# EAGLE design leds_9dof_michi (EAGLE 7.2.0)
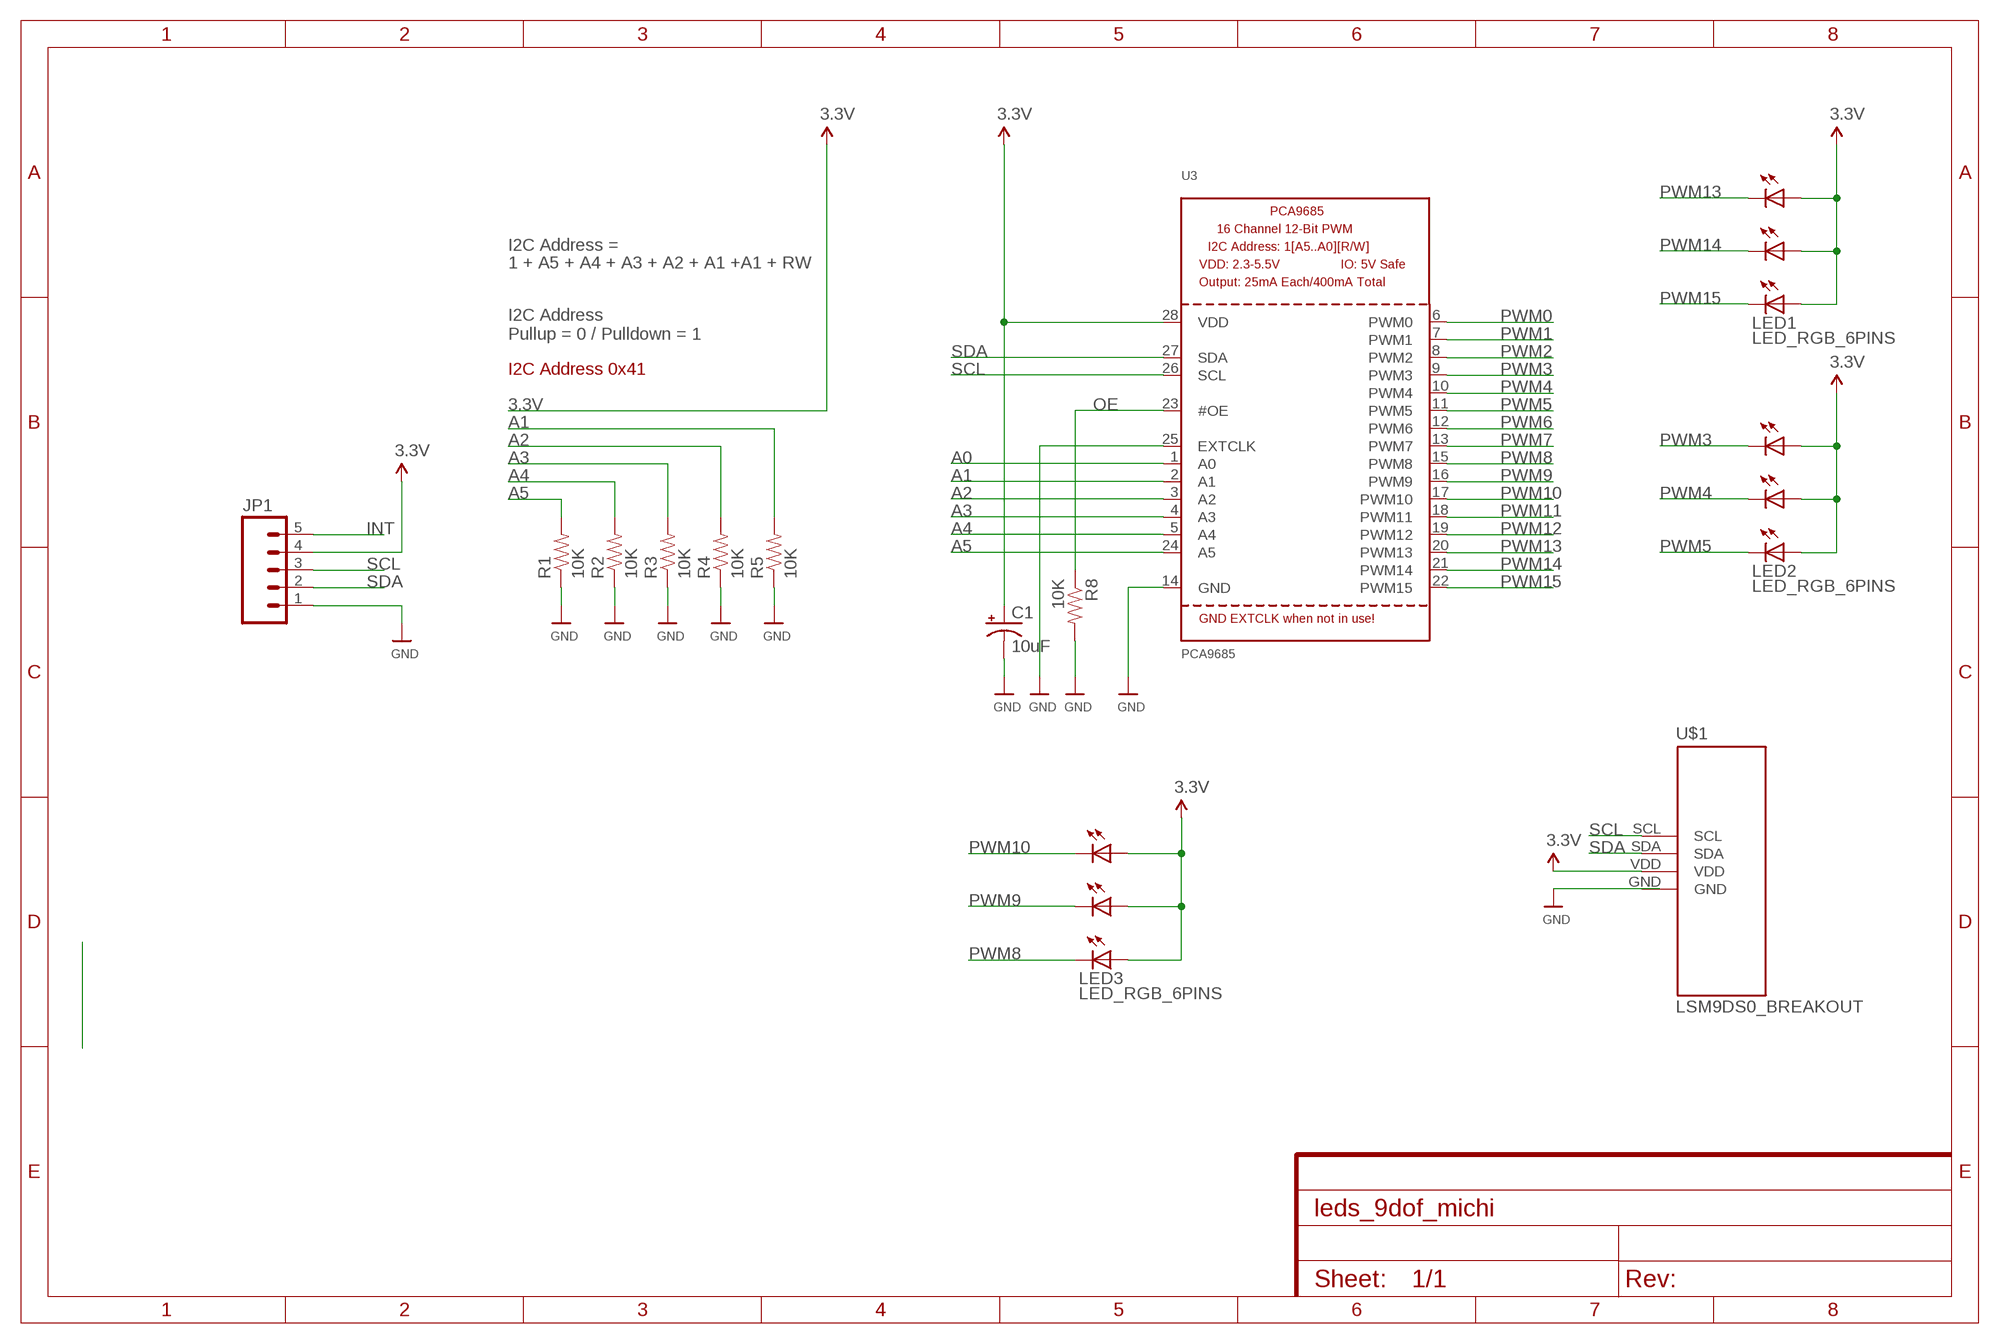
[diagram p0: schematic, sheet 1]

## Parts
C1  10uF  CAP_POL1206  [EIA3216]
JP1  M05PTH  [1X05]
LED1  LED_RGB_6PINS  [LED_RGB_6PINS]
LED2  LED_RGB_6PINS  [LED_RGB_6PINS]
LED3  LED_RGB_6PINS  [LED_RGB_6PINS]
R1  10K  RESISTOR1206  [1206]
R2  10K  RESISTOR1206  [1206]
R3  10K  RESISTOR1206  [1206]
R4  10K  RESISTOR1206  [1206]
R5  10K  RESISTOR1206  [1206]
R8  10K  RESISTOR1206  [1206]
U3  PCA9685  [TSSOP28]
U$1  LSM9DS0_BREAKOUT  [LSM9DS0_BREAKOUT]

## Nets
3.3V: C1.A(+) JP1.4 LED1.BA LED1.GA LED1.RA LED2.BA LED2.GA LED2.RA LED3.BA LED3.GA LED3.RA U3.28(VDD) U$1.VDD
A0: U3.1(A0)
A1: R5.2 U3.2(A1)
A2: R4.2 U3.3(A2)
A3: R3.2 U3.4(A3)
A4: R2.2 U3.5(A4)
A5: R1.2 U3.24(A5)
GND: C1.C(-) JP1.1 R1.1 R2.1 R3.1 R4.1 R5.1 R8.2 U3.14(GND) U3.25(EXTCLK)
INT: JP1.5
OE: R8.1 U3.23(#OE)
PWM0: U3.6(PWM0)
PWM1: U3.7(PWM1)
PWM2: U3.8(PWM2)
PWM3: LED2.BC U3.9(PWM3)
PWM4: LED2.RC U3.10(PWM4)
PWM5: LED2.GC U3.11(PWM5)
PWM6: U3.12(PWM6)
PWM7: U3.13(PWM7)
PWM8: LED3.GC U3.15(PWM8)
PWM9: LED3.RC U3.16(PWM9)
PWM10: LED3.BC U3.17(PWM10)
PWM11: U3.18(PWM11)
PWM12: U3.19(PWM12)
PWM13: LED1.BC U3.20(PWM13)
PWM14: LED1.RC U3.21(PWM14)
PWM15: LED1.GC U3.22(PWM15)
SCL: JP1.3 U3.26(SCL) U$1.SCL
SDA: JP1.2 U3.27(SDA) U$1.SDA

## Notes on the sheet
- I2C Address =
- 1 + A5 + A4 + A3 + A2 + A1 +A1 + RW
- I2C Address
  Pullup = 0 / Pulldown = 1
- I2C Address 0x41

## Power pins joined to a net without a drawn wire
GND: U$1.GND

## Library data of the parts
C1 = SparkFun-Passives:CAP_POL: Capacitor Polarized These are standard SMD and PTH capacitors. Normally 10uF, 47uF, and 100uF in electrolytic and tantalum varieties. Always verify the external diameter of the through hole cap, it varies with capacity, voltage, and manufacturer. The EIA devices should be standard.
JP1 = SparkFun-Connectors:M05: Header 5 Standard 5-pin 0.1" header. Use with straight break away headers (SKU : PRT-00116), right angle break away headers (PRT-00553), swiss pins (PRT-00743), machine pins (PRT-00117), and female headers (PRT-00115). Molex polarized connector foot print use with SKU : PRT-08230 with associated crimp pins and housings.
LED1-LED3 = Mlab_ProEx2015:LED_RGB_6PINS
R1-R5 R8 = SparkFun-Resistors:RESISTOR: Resistor Basic schematic elements and footprints for 0603, 1206, and PTH resistors.
U3 = microbuilder:PCA9685: PCA9685 - 16 Channel 12-Bit I2C PWM Controller 5.0V tolerant 16 channel, 12-bit I2C PWM controller with 25mA per output (max. 400mA total) Digikey: 568-5931-1-ND
U$1 = Mlab_ProEx2015:LSM9DS0_BREAKOUT

## Board
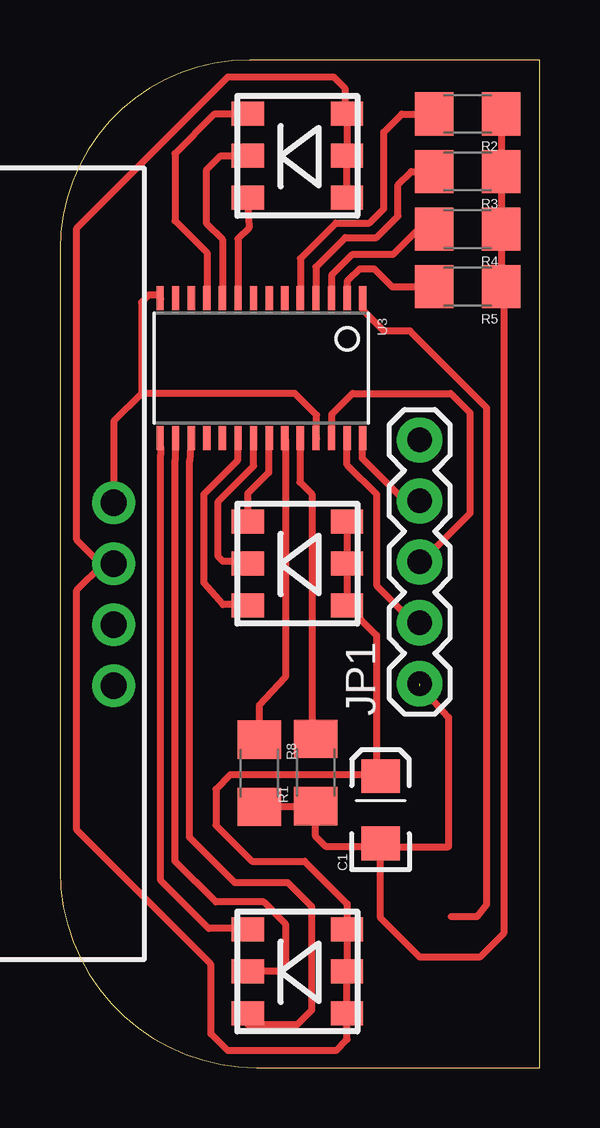
[diagram p1: board, top side]
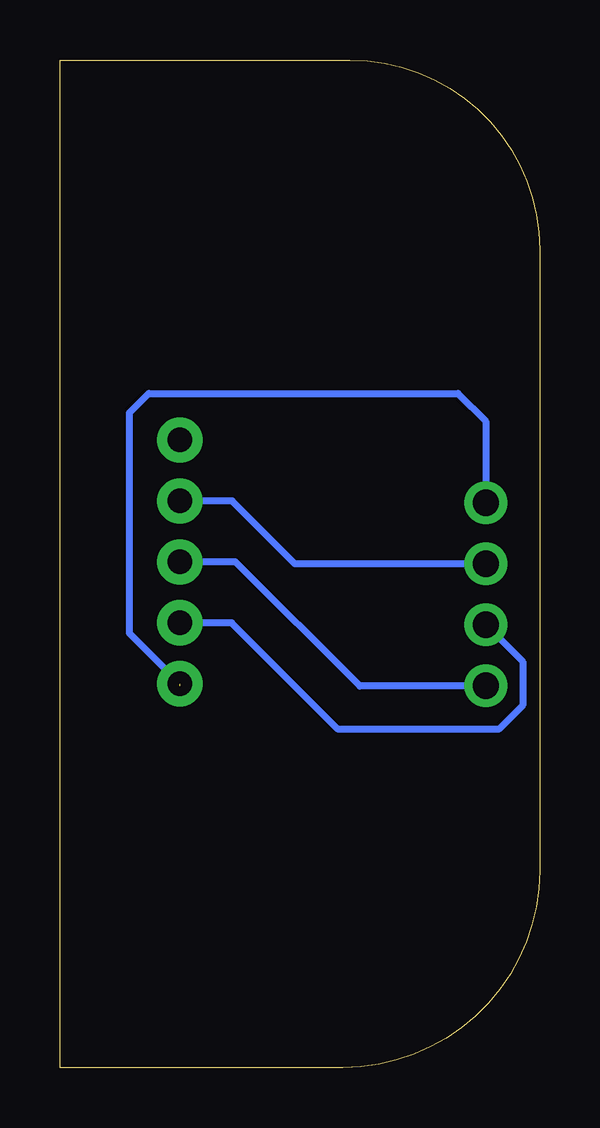
[diagram p2: board, bottom side, seen from below]

Size 20 x 42 mm. Coordinates in mm from the lower left corner, seen from the top.
Outline: 0,8.2 arc90 8.2,0 20,0 20,42 7.9,42 arc90 0,34.1 0,8.2
Copper layers (1*16): Top 0.035mm / dielectric 1.5mm / Bottom 0.035mm
Design rules "mdx40_0mm3_v2": minimum track width 0.2mm, minimum drill 0.6mm, track to track 0.3mm, track to pad 0.3mm, pad to pad 0.3mm, via to via 0.3mm, smd to smd 0.3mm, copper to edge 0.1mm, drill to drill 0.5mm, minimum pad ring 12mil, minimum via ring 10mil, stop-mask expansion 4mil, vias tented up to drill 25mil, thermal gap 0.1mm

### Footprints (pad centres in the part's own frame; a part is rotated, then mirrored left to right if it is on the bottom)
EIA3216 = smd 1.4 x 1.6: A 1.4,0; C -1.4,0
1X05 = drill 1.016 pad 1.88: 1 0,0; 2 2.54,0; 3 5.08,0; 4 7.62,0; 5 10.16,0
LED_RGB_6PINS = smd 1 x 1.35: BA -1.749,-2.07; BC -1.749,2.07; GA 1.751,-2.07; GC 1.751,2.07; RA 0.001,-2.07; RC 0.001,2.07
1206 = smd 1.6 x 1.8: 1 -1.4,0; 2 1.4,0
TSSOP28 = smd 0.305 x 0.991: 1 -4.225,-2.918; 2 -3.575,-2.918; 3 -2.925,-2.918; 4 -2.275,-2.918; 5 -1.625,-2.918; 6 -0.975,-2.918; 7 -0.325,-2.918; 8 0.325,-2.918; 9 0.975,-2.918; 10 1.625,-2.918; 11 2.275,-2.918; 12 2.925,-2.918; 13 3.575,-2.918; 14 4.225,-2.918; 15 4.225,2.918; 16 3.575,2.918; 17 2.925,2.918; 18 2.275,2.918; 19 1.625,2.918; 20 0.975,2.918; 21 0.325,2.918; 22 -0.325,2.918; 23 -0.975,2.918; 24 -1.625,2.918; 25 -2.275,2.918; 26 -2.925,2.918; 27 -3.575,2.918; 28 -4.225,2.918
LSM9DS0_BREAKOUT = drill 1.1 pad 1.778: GND 2.54,-2.54; SCL -5.08,-2.54; SDA -2.54,-2.54; VDD 0,-2.54

### Placement (x,y rotation side)
C1  13.37,10.74 90 top
JP1  15,16 90 top
LED1  9.9,21 90 top
LED2  9.9,38 90 top
LED3  9.9,4 90 top
R1  10.66,12.3 90 top
R2  17,39.75 180 top
R3  17,37.35 180 top
R4  17,34.95 180 top
R5  17,32.55 180 top
R8  8.31,12.27 270 top
U3  8.4,29.16 180 top
U$1  -0.3,21 90 top

### Tracks (layer width: path | path; a pad name or v marks a point on that pad's centre or on a via)
3.3V
  Top 0.3: LED3.BA 12,2.42 | LED3.BA LED3.RA LED3.GA 11.97,6.83 10.2,8.6 8,8.6 6.5,10.1 6.5,11.6 7.1,12.2 12.8,12.2 13.05,12.45 | LED2.BA LED2.RA LED2.GA 11.9,40.32 11.9,40.8 11.4,41.3 7,41.3 0.7,35 0.7,22 1.7,21 U$1.VDD 1.8,21 0.7,19.9 0.7,9.9 6.3,4.3 6.3,1.4 7,0.7 11.5,0.7 11.97,1.17 LED3.BA | LED1.GA LED1.RA LED1.BA 13.2,18.02 13.2,12.6 13.05,12.45 | U3.28 12.6,26.21 12.6,25.4 14.38,23.62 JP1.4 | C1.A 13.06,12.45 13.05,12.45
  Bottom 0.3: U$1.VDD 10.2,21 12.82,23.62 JP1.4
A0
  Top 0.3: 16.3,6.3 17.4,6.3 17.8,6.8 17.8,27.5 14.6,30.7 13.5,30.7 12.62,31.57 U3.1
A1
  Top 0.3: U3.2 11.97,32.77 12.5,33.3 13.1,33.3 13.85,32.55 R5.2
A2
  Top 0.3: U3.3 11.32,33.02 12.2,33.9 13.9,33.9 14.95,34.95 R4.2
A3
  Top 0.3: U3.4 10.68,33.38 11.9,34.6 13.2,34.6 14.1,35.5 14.1,36.8 14.65,37.35 R3.2
A4
  Top 0.3: U3.5 10.03,33.73 11.5,35.2 12.9,35.2 13.5,35.8 13.5,39 14.25,39.75 R2.2
A5
  Top 0.3: U3.24 10,26.21 10,24.4 10.5,23.9 10.5,13.94 R1.2
GND  (1 unrouted)
  Top 0.3: C1.C 13.22,9.2 11.1,9.2 10.66,9.63 R1.1 10.63,10.87 R8.2 | C1.C 13.52,9.2 16.2,9.2 16.2,14.6 15,15.9 | U3.25 10.7,26.21 10.7,27.2 9.8,28.1 3.4,28.1 | 3.4,28.1 2.24,26.94 U$1.GND | 4.2,32.05 U3.14 4.05,32.2 3.7,32.2 3.4,31.9 3.4,28.1 | R2.1 R3.1 R4.1 R5.1 18.5,32.45 18.5,5.6 17.5,4.6 15,4.6 13.37,6.23 C1.C
  Bottom 0.3: JP1.1 17.1,18.1 17.1,27.3 16.3,28.1 3.4,28.1 2.24,26.94 U$1.GND
OE
  Top 0.3: U3.23 9.4,26.16 9.4,16.28 8.31,15.09 R8.1
PWM3
  Top 0.3: LED2.BC 7.88,35 7.42,34.54 U3.9
PWM4
  Top 0.3: U3.10 6.78,34.52 6.1,35.2 6.1,37.4 6.7,38 LED2.RC
PWM5
  Top 0.3: U3.11 6.12,33.98 4.8,35.3 4.8,38.1 6.45,39.75 LED2.GC
PWM8
  Top 0.3: U3.15 4.2,25.56 4.2,7.8 6.2,5.8 7.28,5.8 LED3.GC
PWM9
  Top 0.3: LED3.RC 9.1,4 9.4,4.3 9.4,6 8.5,6.9 6.5,6.9 4.8,8.6 4.8,25.31 U3.16
PWM10
  Top 0.3: LED3.BC 7.83,1.8 9.9,1.8 10.5,2.4 10.5,6.7 9.5,7.7 7.3,7.7 5.4,9.6 5.4,25.26 U3.17
PWM13
  Top 0.3: LED1.BC 7.78,19.3 6.8,19.3 6,20.2 6,23.9 7.42,25.32 U3.20
PWM14
  Top 0.3: LED1.RC 7.73,21.1 6.8,21.1 6.6,21.3 6.6,23.6 8.07,25.07 U3.21
PWM15
  Top 0.3: U3.22 8.7,26.21 8.7,24.8 7.83,23.93 LED1.GC
SCL
  Top 0.3: JP1.3 15.08,21.08 17.1,23.1 17.1,27.3 16.3,28.1 12.2,28.1 11.32,27.23 U3.26
  Bottom 0.3: U$1.SCL 2.36,15.9 7.5,15.9 12.68,21.08 JP1.3
SDA
  Top 0.3: JP1.2 14.76,18.54 13.2,20.1 13.2,23.9 11.97,25.12 U3.27 12,26.21
  Bottom 0.3: U$1.SDA 0.7,16.92 0.7,15.1 1.7,14.1 8.4,14.1 12.84,18.54 JP1.2